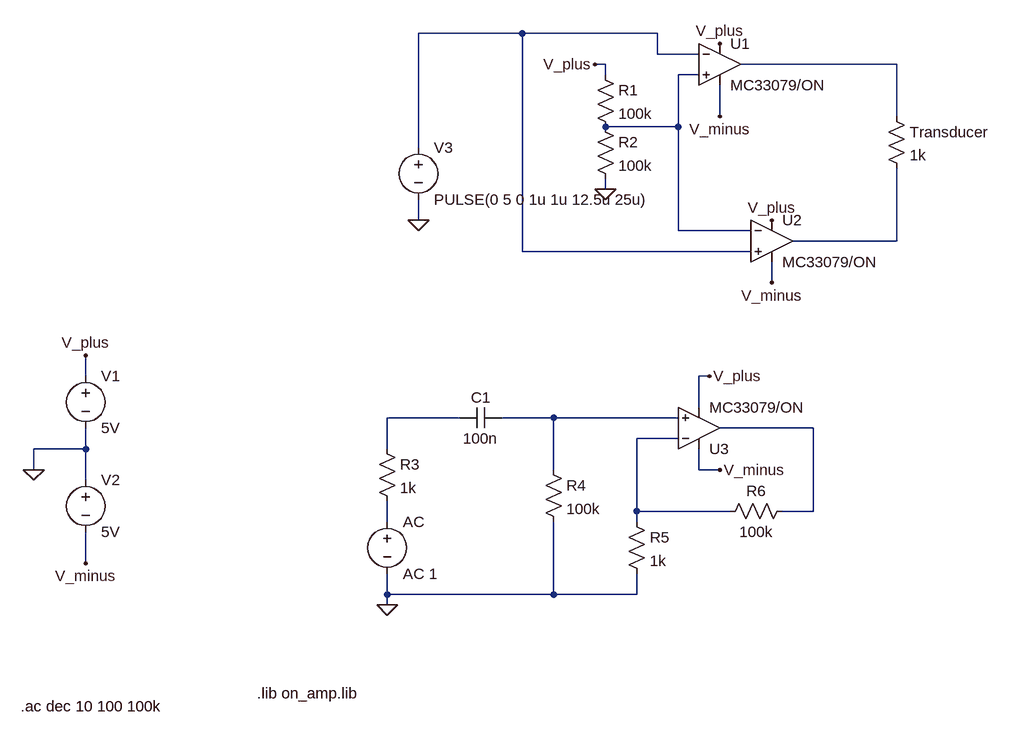
[diagram p0: schematic opamps.asc]
opamps.asc, the LTspice schematic file:
Version 4
SHEET 1 880 680
WIRE 32 -448 -128 -448
WIRE 240 -448 32 -448
WIRE 240 -416 240 -448
WIRE 304 -416 240 -416
WIRE 160 -400 144 -400
WIRE 608 -400 368 -400
WIRE 160 -384 160 -400
WIRE 304 -384 272 -384
WIRE 336 -320 336 -368
WIRE 608 -320 608 -400
WIRE 272 -304 272 -384
WIRE 272 -304 160 -304
WIRE -128 -272 -128 -448
WIRE 160 -208 160 -224
WIRE -128 -160 -128 -192
WIRE 272 -144 272 -304
WIRE 384 -144 272 -144
WIRE 608 -128 608 -240
WIRE 608 -128 448 -128
WIRE 32 -112 32 -448
WIRE 384 -112 32 -112
WIRE 416 -64 416 -96
WIRE -640 80 -640 48
WIRE 320 80 304 80
WIRE 304 128 304 80
WIRE -64 144 -176 144
WIRE 80 144 0 144
WIRE 272 144 80 144
WIRE 480 160 336 160
WIRE 272 176 208 176
WIRE -640 192 -640 160
WIRE -640 192 -720 192
WIRE -176 192 -176 144
WIRE -720 224 -720 192
WIRE 80 224 80 144
WIRE 304 224 304 192
WIRE 336 224 304 224
WIRE -640 240 -640 192
WIRE 208 288 208 176
WIRE 352 288 208 288
WIRE 480 288 480 160
WIRE 480 288 432 288
WIRE -176 304 -176 272
WIRE 208 304 208 288
WIRE -640 368 -640 320
WIRE -176 416 -176 384
WIRE 80 416 80 304
WIRE 80 416 -176 416
WIRE 208 416 208 384
WIRE 208 416 80 416
WIRE -176 432 -176 416
FLAG -720 224 0
FLAG -640 48 V_plus
FLAG -640 368 V_minus
FLAG 416 -64 V_minus
FLAG 336 -320 V_minus
FLAG 336 -432 V_plus
FLAG 416 -160 V_plus
FLAG 160 -208 0
FLAG 144 -400 V_plus
FLAG -128 -160 0
FLAG -176 432 0
FLAG 336 224 V_minus
FLAG 320 80 V_plus
SYMBOL Opamps\\opamp2 336 -464 R0
SYMATTR InstName U1
SYMATTR Value MC33079/ON
SYMBOL Opamps\\opamp2 416 -192 R0
SYMATTR InstName U2
SYMATTR Value MC33079/ON
SYMBOL voltage -640 64 R0
WINDOW 123 0 0 Left 0
WINDOW 39 0 0 Left 0
SYMATTR InstName V1
SYMATTR Value 5V
SYMBOL voltage -640 224 R0
WINDOW 123 0 0 Left 0
WINDOW 39 0 0 Left 0
SYMATTR InstName V2
SYMATTR Value 5V
SYMBOL res 144 -400 R0
SYMATTR InstName R1
SYMATTR Value 100k
SYMBOL res 144 -320 R0
SYMATTR InstName R2
SYMATTR Value 100k
SYMBOL voltage -128 -288 R0
WINDOW 123 0 0 Left 0
WINDOW 39 0 0 Left 0
SYMATTR InstName V3
SYMATTR Value PULSE(0 5 0 1u 1u 12.5u 25u)
SYMBOL res 592 -336 R0
SYMATTR InstName Transducer
SYMATTR Value 1k
SYMBOL voltage -176 288 R0
WINDOW 123 0 0 Left 0
WINDOW 39 0 0 Left 0
SYMATTR InstName AC
SYMATTR Value AC 1
SYMBOL res -192 176 R0
SYMATTR InstName R3
SYMATTR Value 1k
SYMBOL Opamps\\opamp2 304 224 M180
SYMATTR InstName U3
SYMATTR Value MC33079/ON
SYMBOL cap 0 128 R90
WINDOW 0 0 32 VBottom 0
WINDOW 3 32 32 VTop 0
SYMATTR InstName C1
SYMATTR Value 100n
SYMBOL res 64 208 R0
SYMATTR InstName R4
SYMATTR Value 100k
SYMBOL res 192 288 R0
SYMATTR InstName R5
SYMATTR Value 1k
SYMBOL res 448 272 R90
WINDOW 0 0 56 VBottom 0
WINDOW 3 32 56 VTop 0
SYMATTR InstName R6
SYMATTR Value 100k
TEXT -376 568 Left 0 !.lib on_amp.lib
TEXT -740 588 Left 0 !.ac dec 10 100 100k

The netlist it stands for:
* opamps.asc
XU1 N003 N001 V_plus V_minus N002 MC33079/ON  ; pins In+ In- V+ V- OUT
XU2 N001 N003 V_plus V_minus N004 MC33079/ON  ; pins In+ In- V+ V- OUT
V1 V_plus 0 5V
V2 0 V_minus 5V
R1 V_plus N003 100k
R2 N003 0 100k
V3 N001 0 PULSE(0 5 0 1u 1u 12.5u 25u)
R§Transducer N002 N004 1k
V§AC N009 0 AC 1
R3 N005 N009 1k
XU3 N006 N008 V_minus V_plus N007 MC33079/ON  ; pins In+ In- V+ V- OUT
C1 N006 N005 100n
R4 N006 0 100k
R5 N008 0 1k
R6 N007 N008 100k
.lib on_amp.lib
.ac dec 10 100 100k
.backanno
.end